# EAGLE schematic multi-pcb-analog (EAGLE 9.6.2)
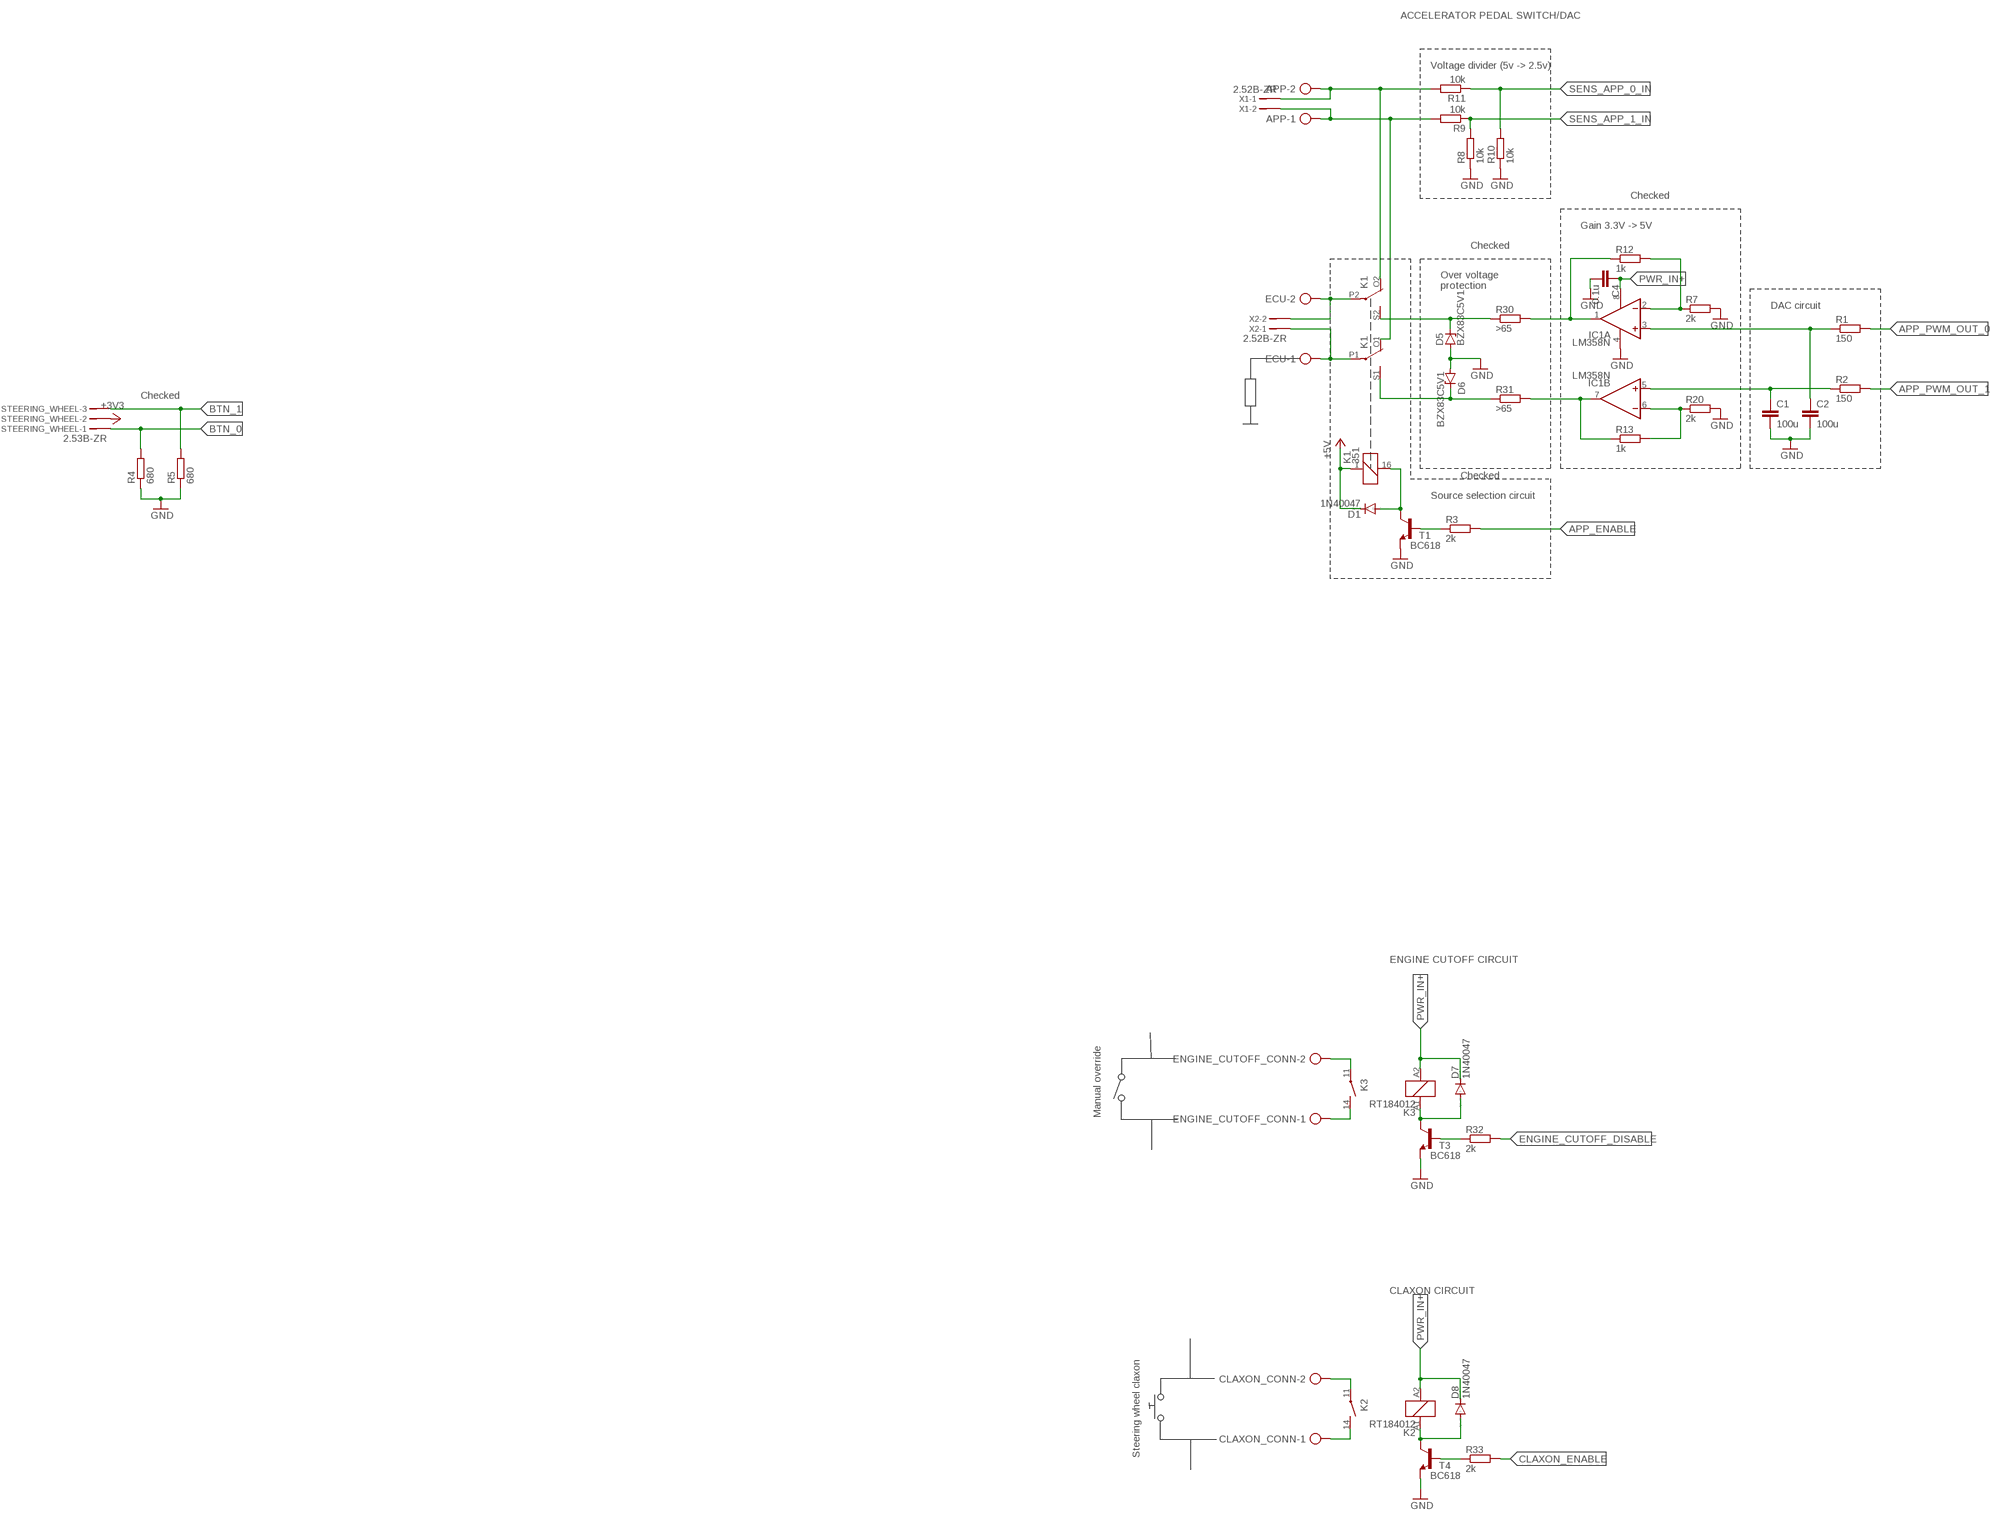
[diagram p0: schematic, sheet 1]

## Parts
APP  AK300/2  [AK300/2]
C1  100u  C-EU025-050X050  [C025-050X050]
C2  100u  C-EU025-050X050  [C025-050X050]
C4  0.1u  C-EU025-050X050  [C025-050X050]
CLAXON_CONN  AK300/2  [AK300/2]
D1  1N40047  [DO41-7.6]
D5  BZX83C5V1  BZX857  [DO41Z7.6]
D6  BZX83C5V1  BZX857  [DO41Z7.6]
D7  1N40047  [DO41-7.6]
D8  1N40047  [DO41-7.6]
ECU  AK300/2  [AK300/2]
ENGINE_CUTOFF_CONN  AK300/2  [AK300/2]
IC1  LM358N  [DIL08]
K1  351  [351]
K2  RT184012  [RT-N/O12A3.5]
K3  RT184012  [RT-N/O12A3.5]
R1  150  R-EU_0309/10  [0309/10]
R2  150  R-EU_0309/10  [0309/10]
R3  2k  R-EU_0207/7  [0207/7]
R4  680  R-EU_0207/7  [0207/7]
R5  680  R-EU_0207/7  [0207/7]
R7  2k  R-EU_0207/7  [0207/7]
R8  10k  R-EU_0207/7  [0207/7]
R9  10k  R-EU_0309/10  [0309/10]
R10  10k  R-EU_0207/7  [0207/7]
R11  10k  R-EU_0309/10  [0309/10]
R12  1k  R-EU_0207/7  [0207/7]
R13  1k  R-EU_0207/7  [0207/7]
R20  2k  R-EU_0207/7  [0207/7]
R30  >65  R-EU_0207/7  [0207/7]
R31  >65  R-EU_0207/7  [0207/7]
R32  2k  R-EU_0309/10  [0309/10]
R33  2k  R-EU_0309/10  [0309/10]
STEERING_WHEEL  2.53B-ZR  [B3B-ZR2.5]
T1  BC618  [TO92-EBC]
T3  BC618  [TO92-EBC]
T4  BC618  [TO92-EBC]
X1  2.52B-ZR  [B2B-ZR2.5]
X2  2.52B-ZR  [B2B-ZR2.5]

## Nets
+3V3: STEERING_WHEEL.2
+5V: D1.C K1.1
APP_0_IN: APP.2 K1.O2(3:O) R11.2 X1.1
APP_1_IN: APP.1 K1.O1(2:O) R9.2 X1.2
APP_ENABLE: R3.2
APP_PWM_OUT_0: R1.2
APP_PWM_OUT_1: R2.2
BTN_0: R4.2 STEERING_WHEEL.1
BTN_1: R5.2 STEERING_WHEEL.3
CLAXON_ENABLE: R33.2
ENGINE_CUTOFF_DISABLE: R32.2
GND: C1.2 C2.2 C4.2 D5.A D6.A IC1.4(P:V-) R4.1 R5.1 R7.2 R8.1 R10.1 R20.2 T1.E T3.E T4.E
N$1: D1.A K1.16 T1.C
N$2: R3.1 T1.B
N$3: D6.C K1.S1(2:S) R31.1
N$4: IC1.1(A:OUT) R12.1 R30.2
N$6: ECU.2 K1.P2(3:P) X2.2
N$7: ECU.1 K1.P1(2:P) X2.1
N$8: C2.1 IC1.3(A:+IN) R1.1
N$9: C1.1 IC1.5(B:+IN) R2.1
N$13: IC1.2(A:-IN) R7.1 R12.2
N$16: IC1.6(B:-IN) R13.2 R20.1
N$17: D5.C K1.S2(3:S) R30.1
N$18: IC1.7(B:OUT) R13.1 R31.2
N$19: ENGINE_CUTOFF_CONN.2 K3.11(2:P)
N$20: ENGINE_CUTOFF_CONN.1 K3.14(2:S)
N$22: D7.A K3.A1 T3.C
N$23: D8.A K2.A1 T4.C
N$25: R33.1 T4.B
N$26: R32.1 T3.B
N$27: CLAXON_CONN.2 K2.11(2:P)
N$28: CLAXON_CONN.1 K2.14(2:S)
PWR_IN+: C4.1 D7.C D8.C IC1.8(P:V+) K2.A2 K3.A2
SENS_APP_0_IN: R10.2 R11.1
SENS_APP_1_IN: R8.2 R9.1

## Notes on the sheet
- ACCELERATOR PEDAL SWITCH/DAC
- Voltage divider (5v -> 2.5v)
- Checked
- Gain 3.3V -> 5V
- Checked
- Over voltage
  protection
- DAC circuit
- Checked
- Checked
- Source selection circuit
- ENGINE CUTOFF CIRCUIT
- Manual override
- CLAXON CIRCUIT
- Steering wheel claxon

## Library data of the parts
APP CLAXON_CONN ECU ENGINE_CUTOFF_CONN = con-ptr500-custom:AK300/2: CONNECTOR; OC_FARNELL: unknown; OC_NEWARK: unknown
C1 C2 C4 = rcl:C-EU: CAPACITOR, European symbol; SPICEPREFIX: C
D1 D7 D8 = diode-custom:1N4004: DIODE general purpose rectifier, 1 A
D5 D6 = diode-custom:BZX85: Z DIODE
IC1 = linear:LM358: OP AMP also LM158; LM258; LM2904 Source: http://cache.national.com/ds/LM/LM158.pdf
K1 = relay:351: RELAY 2 x switch, Omron; OC_FARNELL: unknown; OC_NEWARK: unknown
K2 K3 = relay:RT?*: Power PCB Relay SCHRACK 1 pole 12 / 16 A, DC- or AC-coil Source: http://www.schrack.com/.. 5819.pdf; MF: TYCO ELECTRONICS; MPN: RT184012; OC_FARNELL: unknown; OC_NEWARK: 08H3731
R1-R5 R7-R13 R20 R30-R33 = rcl:R-EU_: RESISTOR, European symbol; SPICEPREFIX: R
STEERING_WHEEL = con-jst-custom:?3B-ZR: ZH CONNECTOR 1.5 mm, 4 pin 1 row Source: http://www.jst.com .. eZH.pdf
T1 T3 T4 = transistor-npn:BC618*: NPN Transistor
X1 X2 = con-jst-custom:?2B-ZR: ZH CONNECTOR 1.5 mm, 4 pin 1 row Source: http://www.jst.com .. eZH.pdf